# Altium schematic sheet 10_HDMI.SchDoc
size A4
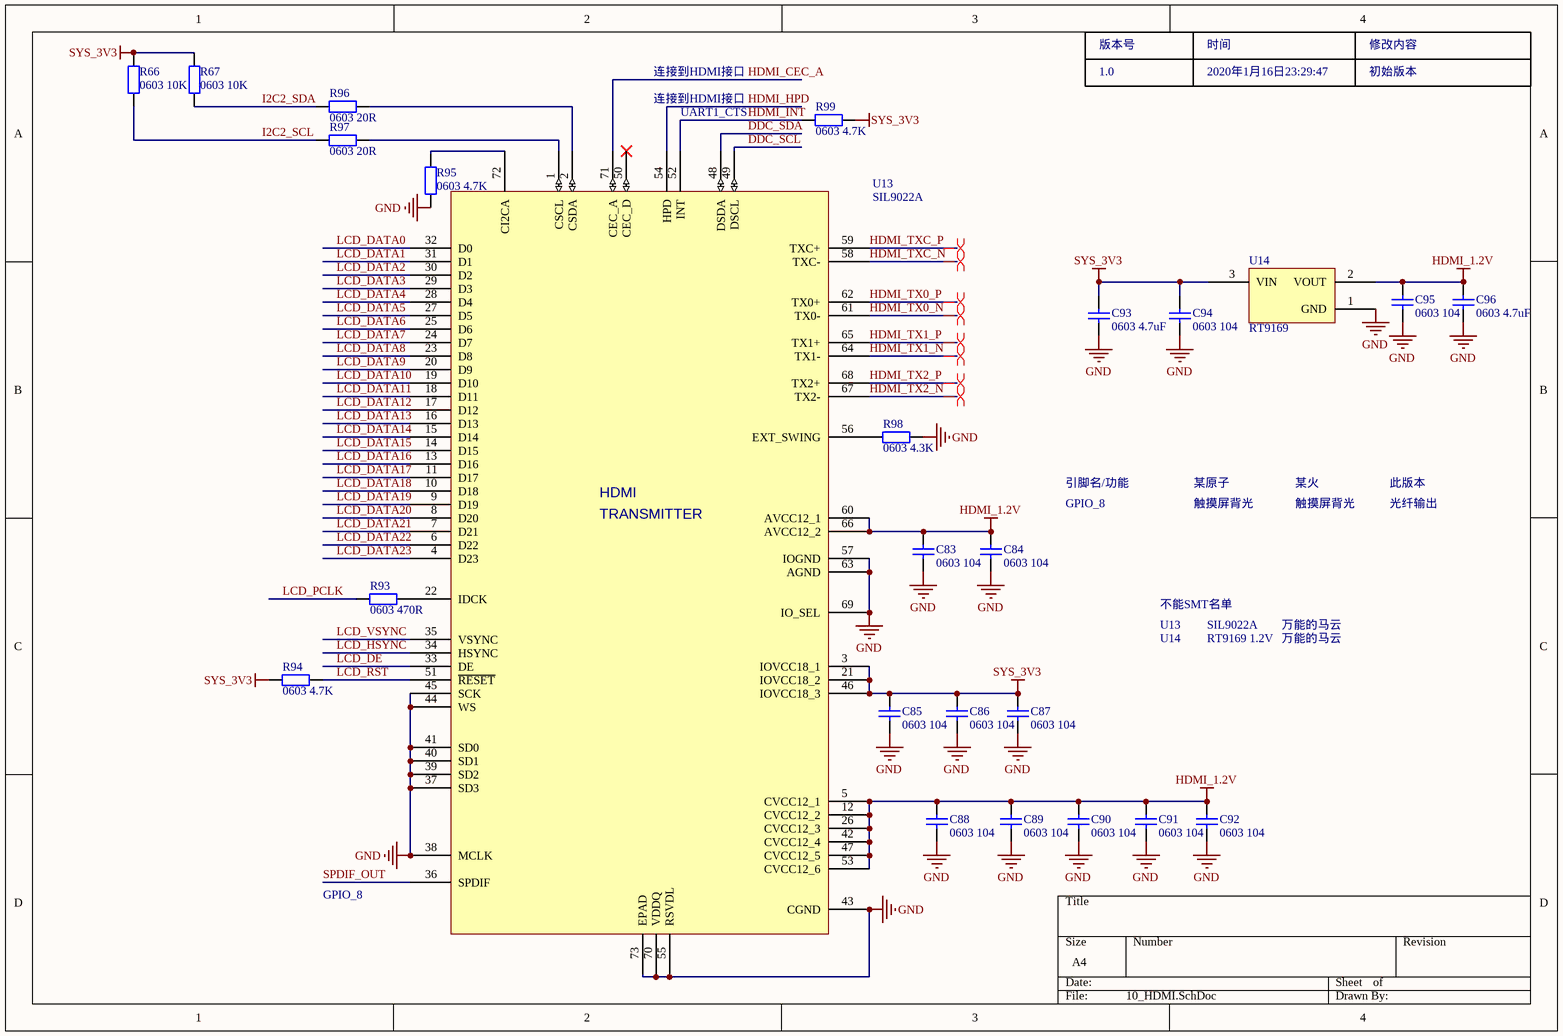
[diagram p0: 10_HDMI.SchDoc]

## Parts
C83  0603 104  [LC-0603_C]
C84  0603 104  [LC-0603_C]
C85  0603 104  [LC-0603_C]
C86  0603 104  [LC-0603_C]
C87  0603 104  [LC-0603_C]
C88  0603 104  [LC-0603_C]
C89  0603 104  [LC-0603_C]
C90  0603 104  [LC-0603_C]
C91  0603 104  [LC-0603_C]
C92  0603 104  [LC-0603_C]
C93  0603 4.7uF  [LC-0603_C]
C94  0603 104  [LC-0603_C]
C95  0603 104  [LC-0603_C]
C96  0603 4.7uF  [LC-0603_C]
R66  0603 10K  [LC-0603_R]
R67  0603 10K  [LC-0603_R]
R93  0603 470R  [LC-0603_R]
R94  0603 4.7K  [LC-0603_R]
R95  0603 4.7K  [LC-0603_R]
R96  0603 20R  [LC-0603_R]
R97  0603 20R  [LC-0603_R]
R98  0603 4.3K  [LC-0603_R]
R99  0603 4.7K  [LC-0603_R]
U13  SIL9022A  [QFN72_10X10]
U14  RT9169  [LC-SOT-23(SOT-23-3)]

## Nets
GND: C83.2 C84.2 C85.2 C86.2 C87.2 C88.2 C89.2 C90.2 C91.2 C92.2 C93.2 C94.2 C95.2 C96.2 R95.2 R98.2 U13.37(SD3) U13.38(MCLK) U13.39(SD2) U13.40(SD1) U13.41(SD0) U13.43(CGND) U13.44(WS) U13.45(SCK) U13.55(RSVDL) U13.57(IOGND) U13.63(AGND) U13.69(IO_SEL) U13.70(VDDQ) U13.73(EPAD) U14.1(GND)
HDMI_1.2V: C83.1 C84.1 C88.1 C89.1 C90.1 C91.1 C92.1 C95.1 C96.1 U13.5(CVCC12_1) U13.12(CVCC12_2) U13.26(CVCC12_3) U13.42(CVCC12_4) U13.47(CVCC12_5) U13.53(CVCC12_6) U13.60(AVCC12_1) U13.66(AVCC12_2) U14.2(VOUT)
SYS_3V3: C85.1 C86.1 C87.1 C93.1 C94.1 R66.2 R67.2 R94.2 R99.2 U13.3(IOVCC18_1) U13.21(IOVCC18_2) U13.46(IOVCC18_3) U14.3(VIN)
DDC_SCL: U13.49(DSCL)
DDC_SDA: U13.48(DSDA)
HDMI_CEC_A: U13.71(CEC_A)
HDMI_HPD: U13.54(HPD)
HDMI_INT: R99.1 U13.52(INT)
HDMI_TX0_N: U13.61(TX0-)
HDMI_TX0_P: U13.62(TX0+)
HDMI_TX1_N: U13.64(TX1-)
HDMI_TX1_P: U13.65(TX1+)
HDMI_TX2_N: U13.67(TX2-)
HDMI_TX2_P: U13.68(TX2+)
HDMI_TXC_N: U13.58(TXC-)
HDMI_TXC_P: U13.59(TXC+)
I2C2_SCL: R66.1 R97.1
I2C2_SDA: R67.1 R96.1
LCD_DATA0: U13.32(D0)
LCD_DATA1: U13.31(D1)
LCD_DATA2: U13.30(D2)
LCD_DATA3: U13.29(D3)
LCD_DATA4: U13.28(D4)
LCD_DATA5: U13.27(D5)
LCD_DATA6: U13.25(D6)
LCD_DATA7: U13.24(D7)
LCD_DATA8: U13.23(D8)
LCD_DATA9: U13.20(D9)
LCD_DATA10: U13.19(D10)
LCD_DATA11: U13.18(D11)
LCD_DATA12: U13.17(D12)
LCD_DATA13: U13.16(D13)
LCD_DATA14: U13.15(D14)
LCD_DATA15: U13.14(D15)
LCD_DATA16: U13.13(D16)
LCD_DATA17: U13.11(D17)
LCD_DATA18: U13.10(D18)
LCD_DATA19: U13.9(D19)
LCD_DATA20: U13.8(D20)
LCD_DATA21: U13.7(D21)
LCD_DATA22: U13.6(D22)
LCD_DATA23: U13.4(D23)
LCD_DE: U13.33(DE)
LCD_HSYNC: U13.34(HSYNC)
LCD_PCLK: R93.2
LCD_RST: R94.1 U13.51(~{RESET})
LCD_VSYNC: U13.35(VSYNC)
SPDIF_OUT: U13.36(SPDIF)
NetR93_1: R93.1 U13.22(IDCK)
NetR95_1: R95.1 U13.72(CI2CA)
NetR96_2: R96.2 U13.2(CSDA)
NetR97_2: R97.2 U13.1(CSCL)
NetR98_1: R98.1 U13.56(EXT_SWING)

Not connected (* = marked no-connect by the designer): U13 50(CEC_D)*

## Layout directives
differential pair: HDMI_TX0_N, HDMI_TX0_P, HDMI_TX1_N, HDMI_TX1_P, HDMI_TX2_N, HDMI_TX2_P, HDMI_TXC_N, HDMI_TXC_P

## Notes on the sheet
- 连接到HDMI接口
- UART1_CTS
- 版本号
- 1.0
- 2020年1月16日23:29:47
- 时间
- 修改内容
- 初始版本
- 引脚名/功能
- GPIO_8
- 某原子
- 触摸屏背光
- 某火
- 此版本
- 光纤输出
- U13
- 不能SMT名单
- U14
- SIL9022A
- RT9169 1.2V
- 万能的马云
- (in symbol SIL9022A) HDMI; TRANSMITTER

## Library data of the parts
C83-C96 = 0603 1.5nF (152) 10% 50V: 贴片电容; ComponentLink1Description: 供应商链接; ComponentLink1URL: http://www.szlcsc.com/product/details_1947.html; Package: 0603; Supplier: LC; SuppliersPartNumber: C1595
R66 R67 R93-R99 = 0603 1.1KΩ (1101) 1%: 贴片电阻; ComponentLink1Description: 供应商链接; ComponentLink1URL: http://www.szlcsc.com/product/details_23491.html; Package: 0603; Supplier: LC; SuppliersPartNumber: C22764